# Altium project PROC154E3_SCH.PrjPcb (part 59 of 60)
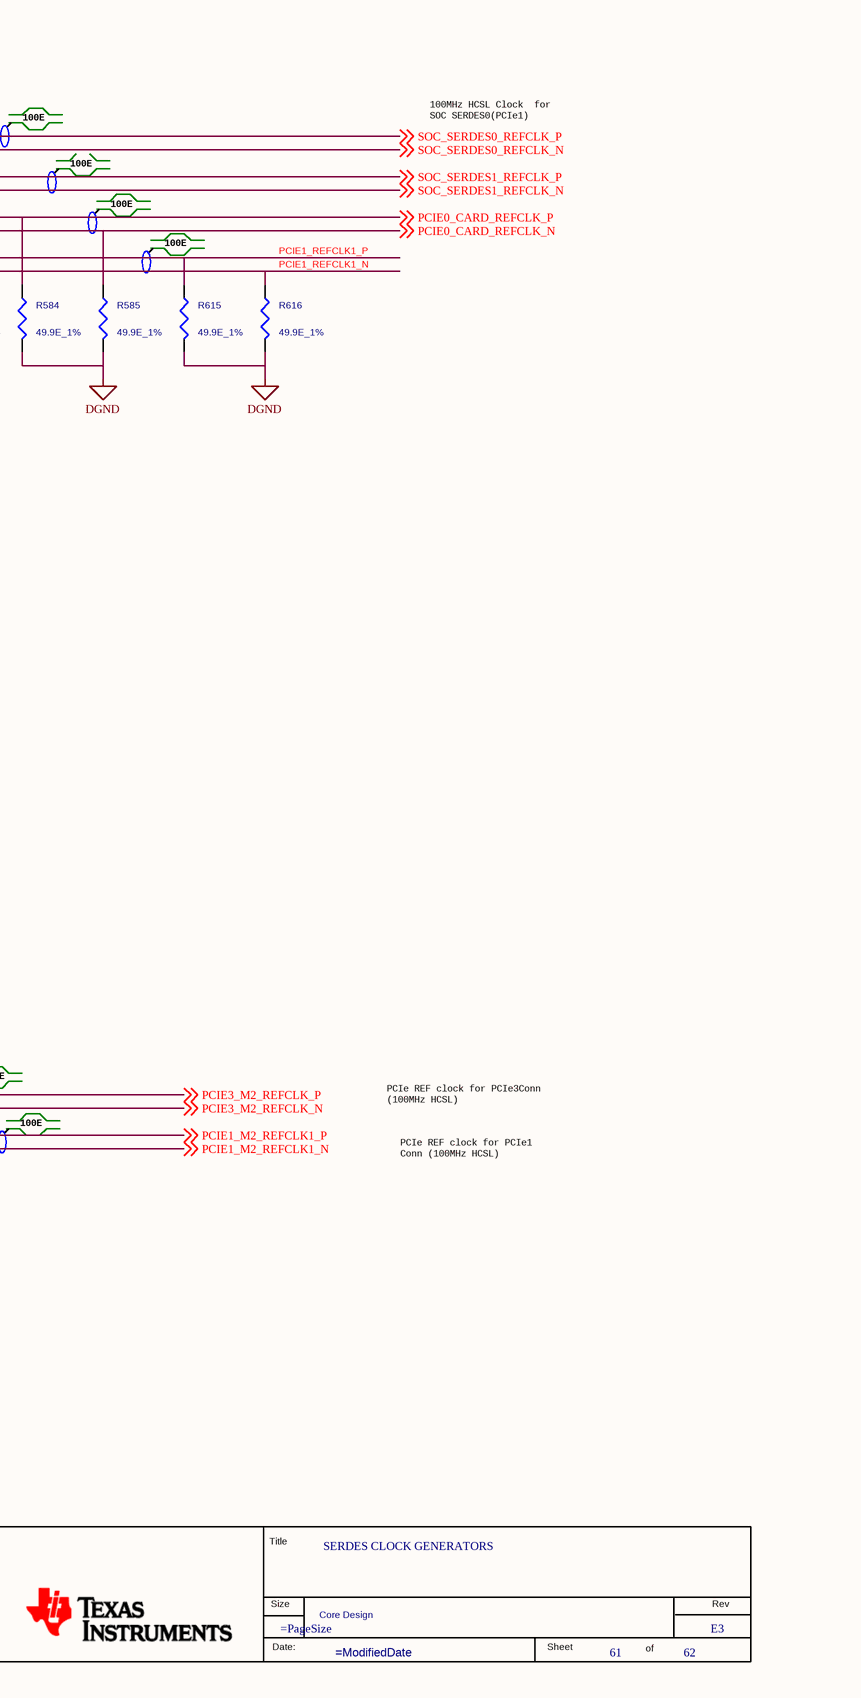
[diagram p206: 61. SERDES CLOCK GENERATORS.SchDoc, right]

## Sheet 61. SERDES CLOCK GENERATORS.SchDoc: SERDES CLOCK GENERATORS (continued)

### Library data of the parts (continued)
R608 = RESISTOR: RES 49.9E 1/10W 1% 0402; Part Reference: R608; Mistral Part No: 110009030897-R; Mfr_name: PANASONIC-ECG; Mfr_part_number: ERJ-2RKF49R9X; Part_type: RESISTORS\FIXED; Project: RED EYE; Voltage: NA; Customs_HS_Code: 85332119; Custom_Duty: 15%; Value: 49.9E_1%; PCB Footprint: RES0402_0-5; Footprint Path: Y:\MIS_DATABASE\Library\ALTIUM_TOOL\PCB_FOOTPRINTS\Altium_Footprint_Lib.PcbLib; Library Path: Y:\MIS_DATABASE\Library\ALTIUM_TOOL\SCHEMATICS_PARTS\MS_DISCRETE_Library.schlib; Tolerance: 1%; Wattage: 1/10W; Package: 0402; Distributor_name: DIGIKEY; Distributor_part_number: P49.9LCT-ND; Height: 0.40MM; Weight: 0.8mg; Temperature: -55°C+155°C; Datasheet: Y:\MIS_DATABASE\DATASHEETS\RESISTORS\PAN-ERJSER_NOV17.PDF; Crtd /date: MAZHAR/201005; Chkd/date: VASANTHA/201216; MECHANICAL 3D STEP FILE: RES0402_0-5; Library Ref: RESISTOR; Footprint Ref: RES0402_0-5; Manufacturer: PANASONIC-ECG
R613 = RESISTOR_Dup1: RES 0E 1/10W JUMPER 0402; Part Reference: R613; Manufacturer: PANASONIC-ECG; Mistral Part No: 110018030052-R; Mfr_part_number: ERJ-2GE0R00X; Part_type: RESISTORS\FIXED; IBISSP_MODLES: VALUE REPEATING 2 TIME; Project: AEGIS POM; Tolerance: NA; Customs_HS_Code: 85332119; Custom_Duty: 15%; Value: 0E; MECHANICAL 3D STEP FILE: RES0402_0-5; Mfr_name: PANASONIC-ECG; Voltage: NA; Wattage: 1/10W; Package: 0402; Distributor_name: DIGIKEY; Distributor_part_number: P0.0JCT-ND; Height: 0.40MM; Weight: 0.8mg; Temperature: -55°C+155°C; Datasheet: Y:\MIS_DATABASE\DATASHEETS\RESISTORS\PAN-ERJSER_NOV17.PDF; Crtd /date: NAVEED/201014; Chkd/date: VASANTHA/061216; Library Ref: RESISTOR; Footprint Ref: RES0402_0-5; Library Path: Y:\MIS_DATABASE\Library\ALTIUM_TOOL\SCHEMATICS_PARTS\MS_DISCRETE_Library.schlib; Footprint Path: Y:\MIS_DATABASE\Library\ALTIUM_TOOL\PCB_FOOTPRINTS\Altium_Footprint_Lib.PcbLib; PCB Footprint: RES0402_0-5
R614 = RESISTOR_Dup1: RES 0E 1/10W JUMPER 0402; Part Reference: R614; Manufacturer: PANASONIC-ECG; Mistral Part No: 110018030052-R; Mfr_part_number: ERJ-2GE0R00X; Part_type: RESISTORS\FIXED; IBISSP_MODLES: VALUE REPEATING 2 TIME; Project: AEGIS POM; Tolerance: NA; Customs_HS_Code: 85332119; Custom_Duty: 15%; Value: 0E; MECHANICAL 3D STEP FILE: RES0402_0-5; Mfr_name: PANASONIC-ECG; Voltage: NA; Wattage: 1/10W; Package: 0402; Distributor_name: DIGIKEY; Distributor_part_number: P0.0JCT-ND; Height: 0.40MM; Weight: 0.8mg; Temperature: -55°C+155°C; Datasheet: Y:\MIS_DATABASE\DATASHEETS\RESISTORS\PAN-ERJSER_NOV17.PDF; Crtd /date: NAVEED/201014; Chkd/date: VASANTHA/061216; Library Ref: RESISTOR; Footprint Ref: RES0402_0-5; Library Path: Y:\MIS_DATABASE\Library\ALTIUM_TOOL\SCHEMATICS_PARTS\MS_DISCRETE_Library.schlib; Footprint Path: Y:\MIS_DATABASE\Library\ALTIUM_TOOL\PCB_FOOTPRINTS\Altium_Footprint_Lib.PcbLib; PCB Footprint: RES0402_0-5
R615 = RESISTOR: RES 49.9E 1/10W 1% 0402; Part Reference: R615; Mistral Part No: 110009030897-R; Mfr_name: PANASONIC-ECG; Mfr_part_number: ERJ-2RKF49R9X; Part_type: RESISTORS\FIXED; Project: RED EYE; Voltage: NA; Customs_HS_Code: 85332119; Custom_Duty: 15%; Value: 49.9E_1%; PCB Footprint: RES0402_0-5; Footprint Ref: RES0402_0-5; Library Ref: RESISTOR; Footprint Path: Y:\MIS_DATABASE\Library\ALTIUM_TOOL\PCB_FOOTPRINTS\Altium_Footprint_Lib.PcbLib; Library Path: Y:\MIS_DATABASE\Library\ALTIUM_TOOL\SCHEMATICS_PARTS\MS_DISCRETE_Library.schlib; Tolerance: 1%; Wattage: 1/10W; Package: 0402; Distributor_name: DIGIKEY; Distributor_part_number: P49.9LCT-ND; Height: 0.40MM; Weight: 0.8mg; Temperature: -55°C+155°C; Datasheet: Y:\MIS_DATABASE\DATASHEETS\RESISTORS\PAN-ERJSER_NOV17.PDF; Crtd /date: MAZHAR/201005; Chkd/date: VASANTHA/201216; MECHANICAL 3D STEP FILE: RES0402_0-5; Manufacturer: PANASONIC-ECG
R616 = RESISTOR: RES 49.9E 1/10W 1% 0402; Part Reference: R616; Manufacturer: PANASONIC-ECG; Mistral Part No: 110009030897-R; Mfr_part_number: ERJ-2RKF49R9X; Part_type: RESISTORS\FIXED; Project: RED EYE; Voltage: NA; Customs_HS_Code: 85332119; Custom_Duty: 15%; Value: 49.9E_1%; PCB Footprint: RES0402_0-5; Footprint Ref: RES0402_0-5; Library Ref: RESISTOR; Mfr_name: PANASONIC-ECG; Tolerance: 1%; Wattage: 1/10W; Package: 0402; Distributor_name: DIGIKEY; Distributor_part_number: P49.9LCT-ND; Height: 0.40MM; Weight: 0.8mg; Temperature: -55°C+155°C; Datasheet: Y:\MIS_DATABASE\DATASHEETS\RESISTORS\PAN-ERJSER_NOV17.PDF; Crtd /date: MAZHAR/201005; Chkd/date: VASANTHA/201216; MECHANICAL 3D STEP FILE: RES0402_0-5; Library Path: Y:\MIS_DATABASE\Library\ALTIUM_TOOL\SCHEMATICS_PARTS\MS_DISCRETE_Library.schlib; Footprint Path: Y:\MIS_DATABASE\Library\ALTIUM_TOOL\PCB_FOOTPRINTS\Altium_Footprint_Lib.PcbLib
R617 = RESISTOR_Dup2: RES 10K 1/16W 5% 0402; Part Reference: R617; Mistral Part No: 110011060021-R; Mfr_name: YAGEO AMERICA; Mfr_part_number: RC0402JR-0710KL; Part_type: RESISTORS\FIXED; Project: HSE; Voltage: NA; Customs_HS_Code: 85332119; Custom_Duty: 15%; Value: 10K; Footprint Path: Y:\MIS_DATABASE\Library\ALTIUM_TOOL\PCB_FOOTPRINTS\Altium_Footprint_Lib.PcbLib; Library Path: Y:\MIS_DATABASE\Library\ALTIUM_TOOL\SCHEMATICS_PARTS\MS_DISCRETE_Library.schlib; Footprint Ref: RES0402_0-5; Library Ref: RESISTOR; Tolerance: 5%; Wattage: 1/16W; Package: 0402; Distributor_name: DIGIKEY; Distributor_part_number: 311-10KJRCT-ND; Height: 0.40MM; Weight: 0.65mg; Temperature: -55°C+155°C; Datasheet: Y:\MIS_DATABASE\DATASHEETS\RESISTORS\RCXXXXL-SER_MAR18.PDF; Crtd /date: MAZHAR/230805; Chkd/date: VASANTHA/061216; MECHANICAL 3D STEP FILE: RES0402_0-5; Manufacturer: YAGEO AMERICA; PCB Footprint: RES0402_0-5
R618 = RESISTOR_Dup2: RES 10K 1/16W 5% 0402; Part Reference: R618; Manufacturer: YAGEO AMERICA; Part_type: RESISTORS\FIXED; Mfr_part_number: RC0402JR-0710KL; Mistral Part No: 110011060021-R; Custom_Duty: 15%; Customs_HS_Code: 85332119; Voltage: NA; Project: HSE; Value: 10K; MECHANICAL 3D STEP FILE: RES0402_0-5; Chkd/date: VASANTHA/061216; Crtd /date: MAZHAR/230805; Datasheet: Y:\MIS_DATABASE\DATASHEETS\RESISTORS\RCXXXXL-SER_MAR18.PDF; Temperature: -55°C+155°C; Weight: 0.65mg; Height: 0.40MM; Distributor_part_number: 311-10KJRCT-ND; Distributor_name: DIGIKEY; Package: 0402; Wattage: 1/16W; Tolerance: 5%; Mfr_name: YAGEO AMERICA; Library Ref: RESISTOR; Footprint Ref: RES0402_0-5; Library Path: Y:\MIS_DATABASE\Library\ALTIUM_TOOL\SCHEMATICS_PARTS\MS_DISCRETE_Library.schlib; Footprint Path: Y:\MIS_DATABASE\Library\ALTIUM_TOOL\PCB_FOOTPRINTS\Altium_Footprint_Lib.PcbLib; PCB Footprint: RES0402_0-5
R619 = RESISTOR_Dup2: RES 10K 1/16W 5% 0402; Part Reference: R619; Manufacturer: YAGEO AMERICA; Part_type: RESISTORS\FIXED; Mfr_part_number: RC0402JR-0710KL; Mistral Part No: 110011060021-R; Custom_Duty: 15%; Customs_HS_Code: 85332119; Voltage: NA; Project: HSE; Value: 10K; MECHANICAL 3D STEP FILE: RES0402_0-5; Chkd/date: VASANTHA/061216; Crtd /date: MAZHAR/230805; Datasheet: Y:\MIS_DATABASE\DATASHEETS\RESISTORS\RCXXXXL-SER_MAR18.PDF; Temperature: -55°C+155°C; Weight: 0.65mg; Height: 0.40MM; Distributor_part_number: 311-10KJRCT-ND; Distributor_name: DIGIKEY; Package: 0402; Wattage: 1/16W; Tolerance: 5%; Mfr_name: YAGEO AMERICA; Library Ref: RESISTOR; Footprint Ref: RES0402_0-5; Library Path: Y:\MIS_DATABASE\Library\ALTIUM_TOOL\SCHEMATICS_PARTS\MS_DISCRETE_Library.schlib; Footprint Path: Y:\MIS_DATABASE\Library\ALTIUM_TOOL\PCB_FOOTPRINTS\Altium_Footprint_Lib.PcbLib; PCB Footprint: RES0402_0-5
R689 = RESISTOR: RES 33E 1/10W 1% 0402; Part Reference: R689; Manufacturer: PANASONIC-ECG; Mistral Part No: 110014110006-R; Mfr_part_number: ERJ-2RKF33R0X; Part_type: RESISTORS\FIXED; Project: ZK BIOMETRIC; Voltage: NA; Customs_HS_Code: 85332119; Custom_Duty: 15%; Value: 33E_1%; PCB Footprint: RES0402_0-5; Mfr_name: PANASONIC-ECG; Tolerance: 1%; Wattage: 1/10W; Package: 0402; Distributor_name: DIGIKEY; Distributor_part_number: P33.0LCT-ND; Height: 0.40MM; Weight: 0.8mg; Temperature: -55°C+155°C; Datasheet: Y:\MIS_DATABASE\DATASHEETS\RESISTORS\PAN-ERJSER_NOV17.PDF; Crtd /date: JEBRAN/171114; Chkd/date: VASANTHA/061216; MECHANICAL 3D STEP FILE: RES0402_0-5; Library Ref: RESISTOR; Footprint Ref: RES0402_0-5; Library Path: Y:\MIS_DATABASE\Library\ALTIUM_TOOL\SCHEMATICS_PARTS\MS_DISCRETE_Library.schlib; Footprint Path: Y:\MIS_DATABASE\Library\ALTIUM_TOOL\PCB_FOOTPRINTS\Altium_Footprint_Lib.PcbLib
R690 = RESISTOR: RES 33E 1/10W 1% 0402; Part Reference: R690; Manufacturer: PANASONIC-ECG; Part_type: RESISTORS\FIXED; Mfr_part_number: ERJ-2RKF33R0X; Mistral Part No: 110014110006-R; Custom_Duty: 15%; Customs_HS_Code: 85332119; Voltage: NA; Project: ZK BIOMETRIC; Value: 33E_1%; PCB Footprint: RES0402_0-5; MECHANICAL 3D STEP FILE: RES0402_0-5; Chkd/date: VASANTHA/061216; Crtd /date: JEBRAN/171114; Datasheet: Y:\MIS_DATABASE\DATASHEETS\RESISTORS\PAN-ERJSER_NOV17.PDF; Temperature: -55°C+155°C; Weight: 0.8mg; Height: 0.40MM; Distributor_part_number: P33.0LCT-ND; Distributor_name: DIGIKEY; Package: 0402; Wattage: 1/10W; Tolerance: 1%; Mfr_name: PANASONIC-ECG; Library Ref: RESISTOR; Footprint Ref: RES0402_0-5; Library Path: Y:\MIS_DATABASE\Library\ALTIUM_TOOL\SCHEMATICS_PARTS\MS_DISCRETE_Library.schlib; Footprint Path: Y:\MIS_DATABASE\Library\ALTIUM_TOOL\PCB_FOOTPRINTS\Altium_Footprint_Lib.PcbLib
R691 = RESISTOR: RES 33E 1/10W 1% 0402; Part Reference: R691; Mistral Part No: 110014110006-R; Mfr_name: PANASONIC-ECG; Mfr_part_number: ERJ-2RKF33R0X; Part_type: RESISTORS\FIXED; Project: ZK BIOMETRIC; Voltage: NA; Customs_HS_Code: 85332119; Custom_Duty: 15%; Value: 33E_1%; PCB Footprint: RES0402_0-5; Footprint Path: Y:\MIS_DATABASE\Library\ALTIUM_TOOL\PCB_FOOTPRINTS\Altium_Footprint_Lib.PcbLib; Library Path: Y:\MIS_DATABASE\Library\ALTIUM_TOOL\SCHEMATICS_PARTS\MS_DISCRETE_Library.schlib; Footprint Ref: RES0402_0-5; Library Ref: RESISTOR; Tolerance: 1%; Wattage: 1/10W; Package: 0402; Distributor_name: DIGIKEY; Distributor_part_number: P33.0LCT-ND; Height: 0.40MM; Weight: 0.8mg; Temperature: -55°C+155°C; Datasheet: Y:\MIS_DATABASE\DATASHEETS\RESISTORS\PAN-ERJSER_NOV17.PDF; Crtd /date: JEBRAN/171114; Chkd/date: VASANTHA/061216; MECHANICAL 3D STEP FILE: RES0402_0-5; Manufacturer: PANASONIC-ECG
R692 = RESISTOR: RES 33E 1/10W 1% 0402; Part Reference: R692; Part_type: RESISTORS\FIXED; Mfr_part_number: ERJ-2RKF33R0X; Mfr_name: PANASONIC-ECG; Mistral Part No: 110014110006-R; Custom_Duty: 15%; Customs_HS_Code: 85332119; Voltage: NA; Project: ZK BIOMETRIC; Value: 33E_1%; PCB Footprint: RES0402_0-5; Footprint Path: Y:\MIS_DATABASE\Library\ALTIUM_TOOL\PCB_FOOTPRINTS\Altium_Footprint_Lib.PcbLib; Library Path: Y:\MIS_DATABASE\Library\ALTIUM_TOOL\SCHEMATICS_PARTS\MS_DISCRETE_Library.schlib; Footprint Ref: RES0402_0-5; Library Ref: RESISTOR; MECHANICAL 3D STEP FILE: RES0402_0-5; Chkd/date: VASANTHA/061216; Crtd /date: JEBRAN/171114; Datasheet: Y:\MIS_DATABASE\DATASHEETS\RESISTORS\PAN-ERJSER_NOV17.PDF; Temperature: -55°C+155°C; Weight: 0.8mg; Height: 0.40MM; Distributor_part_number: P33.0LCT-ND; Distributor_name: DIGIKEY; Package: 0402; Wattage: 1/10W; Tolerance: 1%; Manufacturer: PANASONIC-ECG
R693 = RESISTOR: RES 33E 1/10W 1% 0402; Part Reference: R693; Manufacturer: PANASONIC-ECG; Part_type: RESISTORS\FIXED; Mfr_part_number: ERJ-2RKF33R0X; Mistral Part No: 110014110006-R; Custom_Duty: 15%; Customs_HS_Code: 85332119; Voltage: NA; Project: ZK BIOMETRIC; Value: 33E_1%; PCB Footprint: RES0402_0-5; MECHANICAL 3D STEP FILE: RES0402_0-5; Chkd/date: VASANTHA/061216; Crtd /date: JEBRAN/171114; Datasheet: Y:\MIS_DATABASE\DATASHEETS\RESISTORS\PAN-ERJSER_NOV17.PDF; Temperature: -55°C+155°C; Weight: 0.8mg; Height: 0.40MM; Distributor_part_number: P33.0LCT-ND; Distributor_name: DIGIKEY; Package: 0402; Wattage: 1/10W; Tolerance: 1%; Mfr_name: PANASONIC-ECG; Library Ref: RESISTOR; Footprint Ref: RES0402_0-5; Library Path: Y:\MIS_DATABASE\Library\ALTIUM_TOOL\SCHEMATICS_PARTS\MS_DISCRETE_Library.schlib; Footprint Path: Y:\MIS_DATABASE\Library\ALTIUM_TOOL\PCB_FOOTPRINTS\Altium_Footprint_Lib.PcbLib
R694 = RESISTOR: RES 33E 1/10W 1% 0402; Part Reference: R694; Manufacturer: PANASONIC-ECG; Mistral Part No: 110014110006-R; Mfr_part_number: ERJ-2RKF33R0X; Part_type: RESISTORS\FIXED; Project: ZK BIOMETRIC; Voltage: NA; Customs_HS_Code: 85332119; Custom_Duty: 15%; Value: 33E_1%; PCB Footprint: RES0402_0-5; Mfr_name: PANASONIC-ECG; Tolerance: 1%; Wattage: 1/10W; Package: 0402; Distributor_name: DIGIKEY; Distributor_part_number: P33.0LCT-ND; Height: 0.40MM; Weight: 0.8mg; Temperature: -55°C+155°C; Datasheet: Y:\MIS_DATABASE\DATASHEETS\RESISTORS\PAN-ERJSER_NOV17.PDF; Crtd /date: JEBRAN/171114; Chkd/date: VASANTHA/061216; MECHANICAL 3D STEP FILE: RES0402_0-5; Library Ref: RESISTOR; Footprint Ref: RES0402_0-5; Library Path: Y:\MIS_DATABASE\Library\ALTIUM_TOOL\SCHEMATICS_PARTS\MS_DISCRETE_Library.schlib; Footprint Path: Y:\MIS_DATABASE\Library\ALTIUM_TOOL\PCB_FOOTPRINTS\Altium_Footprint_Lib.PcbLib
R695 = RESISTOR: RES 4.7K 1/16W 5% 0402; Part Reference: R695; Mistral Part No: 110011060001-R; Mfr_name: YAGEO AMERICA; Mfr_part_number: RC0402JR-074K7L; Part_type: RESISTORS\FIXED; Project: TMDXCSK368; Voltage: NA; Customs_HS_Code: 85332119; Custom_Duty: 15%; Value: 4.7K; PCB Footprint: RES0402_0-5; Tolerance: 5%; Wattage: 1/16W; Package: 0402; Distributor_name: DIGIKEY; Distributor_part_number: 311-4.7KJRCT-ND; Height: 0.40MM; Weight: 0.65mg; Temperature: -55°C+155°C; Datasheet: Y:\MIS_DATABASE\DATASHEETS\RESISTORS\RCXXXXL-SER_MAR18.PDF; Crtd /date: VASANTHA/130516; Chkd/date: VASANTHA/130516; Library Ref: RESISTOR; Footprint Ref: RES0402_0-5; MECHANICAL 3D STEP FILE: RES0402_0-5; Library Path: Y:\MIS_DATABASE\Library\ALTIUM_TOOL\SCHEMATICS_PARTS\MS_DISCRETE_Library.schlib; Footprint Path: Y:\MIS_DATABASE\Library\ALTIUM_TOOL\PCB_FOOTPRINTS\Altium_Footprint_Lib.PcbLib; Manufacturer: YAGEO AMERICA
R696 = RESISTOR: RES 4.7K 1/16W 5% 0402; Part Reference: R696; Manufacturer: YAGEO AMERICA; Part_type: RESISTORS\FIXED; Mfr_part_number: RC0402JR-074K7L; Mistral Part No: 110011060001-R; Custom_Duty: 15%; Customs_HS_Code: 85332119; Voltage: NA; Project: TMDXCSK368; Value: 4.7K; Footprint Path: Y:\MIS_DATABASE\Library\ALTIUM_TOOL\PCB_FOOTPRINTS\Altium_Footprint_Lib.PcbLib; Library Path: Y:\MIS_DATABASE\Library\ALTIUM_TOOL\SCHEMATICS_PARTS\MS_DISCRETE_Library.schlib; MECHANICAL 3D STEP FILE: RES0402_0-5; Footprint Ref: RES0402_0-5; Library Ref: RESISTOR; Chkd/date: VASANTHA/130516; Crtd /date: VASANTHA/130516; Datasheet: Y:\MIS_DATABASE\DATASHEETS\RESISTORS\RCXXXXL-SER_MAR18.PDF; Temperature: -55°C+155°C; Weight: 0.65mg; Height: 0.40MM; Distributor_part_number: 311-4.7KJRCT-ND; Distributor_name: DIGIKEY; Package: 0402; Wattage: 1/16W; Tolerance: 5%; Mfr_name: YAGEO AMERICA; PCB Footprint: RES0402_0-5
TP102 = TESTPOINT_Dup1: TESTPOINT CIR 40 SMD; Part Reference: TP102; Mfr_name: LOCAL; Mistral Part No: 130009030933; MECHANICAL 3D STEP FILE: NA; Project: RAINIER-3; Value: TP40_SMD; PCB Footprint: TP40_SMD; Footprint Ref: TP40_SMD; Library Ref: TESTPOINT; Footprint Path: Y:\MIS_DATABASE\Library\ALTIUM_TOOL\PCB_FOOTPRINTS\Altium_Footprint_Lib.PcbLib; Library Path: Y:\MIS_DATABASE\Library\ALTIUM_TOOL\SCHEMATICS_PARTS\MS_DISCRETE_Library.schlib; Chkd/date: MAZHAR/190505; Crtd /date: MAZHAR/190505; Datasheet: NA; Temperature: NA; Weight: NA; Height: NA; Distributor_part_number: NA; Distributor_name: NA; Package: SMD; Wattage: NA; Voltage: NA; Tolerance: NA; Part_type: TESTPOINT; Mfr_part_number: TP40_SMD; RoHS: NA; Manufacturer: LOCAL
TP103 = TESTPOINT_Dup1: TESTPOINT CIR 40 SMD; Part Reference: TP103; Mfr_name: LOCAL; Mistral Part No: 130009030933; MECHANICAL 3D STEP FILE: NA; Project: RAINIER-3; Value: TP40_SMD; Footprint Ref: TP40_SMD; Library Ref: TESTPOINT; Footprint Path: Y:\MIS_DATABASE\Library\ALTIUM_TOOL\PCB_FOOTPRINTS\Altium_Footprint_Lib.PcbLib; Library Path: Y:\MIS_DATABASE\Library\ALTIUM_TOOL\SCHEMATICS_PARTS\MS_DISCRETE_Library.schlib; Chkd/date: MAZHAR/190505; Crtd /date: MAZHAR/190505; Datasheet: NA; Temperature: NA; Weight: NA; Height: NA; Distributor_part_number: NA; Distributor_name: NA; Package: SMD; Wattage: NA; Voltage: NA; Tolerance: NA; Part_type: TESTPOINT; Mfr_part_number: TP40_SMD; RoHS: NA; Manufacturer: LOCAL; PCB Footprint: TP40_SMD
TP112 = TESTPOINT_Dup1: TESTPOINT CIR 40 SMD; Part Reference: TP112; Mfr_name: LOCAL; Mistral Part No: 130009030933; MECHANICAL 3D STEP FILE: NA; Project: RAINIER-3; Value: TP40_SMD; PCB Footprint: TP40_SMD; Footprint Ref: TP40_SMD; Library Ref: TESTPOINT; Footprint Path: Y:\MIS_DATABASE\Library\ALTIUM_TOOL\PCB_FOOTPRINTS\Altium_Footprint_Lib.PcbLib; Library Path: Y:\MIS_DATABASE\Library\ALTIUM_TOOL\SCHEMATICS_PARTS\MS_DISCRETE_Library.schlib; Chkd/date: MAZHAR/190505; Crtd /date: MAZHAR/190505; Datasheet: NA; Temperature: NA; Weight: NA; Height: NA; Distributor_part_number: NA; Distributor_name: NA; Package: SMD; Wattage: NA; Voltage: NA; Tolerance: NA; Part_type: TESTPOINT; Mfr_part_number: TP40_SMD; RoHS: NA; Manufacturer: LOCAL
TP113 = TESTPOINT_Dup1: TESTPOINT CIR 40 SMD; Part Reference: TP113; Mfr_name: LOCAL; Mistral Part No: 130009030933; MECHANICAL 3D STEP FILE: NA; Project: RAINIER-3; Value: TP40_SMD; PCB Footprint: TP40_SMD; Footprint Ref: TP40_SMD; Library Ref: TESTPOINT; Footprint Path: Y:\MIS_DATABASE\Library\ALTIUM_TOOL\PCB_FOOTPRINTS\Altium_Footprint_Lib.PcbLib; Library Path: Y:\MIS_DATABASE\Library\ALTIUM_TOOL\SCHEMATICS_PARTS\MS_DISCRETE_Library.schlib; Chkd/date: MAZHAR/190505; Crtd /date: MAZHAR/190505; Datasheet: NA; Temperature: NA; Weight: NA; Height: NA; Distributor_part_number: NA; Distributor_name: NA; Package: SMD; Wattage: NA; Voltage: NA; Tolerance: NA; Part_type: TESTPOINT; Mfr_part_number: TP40_SMD; RoHS: NA; Manufacturer: LOCAL
U112 = CDCI6214RGET_VQFN24: IC PCIE GEN4 CLOCK GENERATOR WITH PROGRAMMABLE O/P AND EEPROM VQFN24; Part Reference: U112; Manufacturer: TEXAS INSTRUMENTS; Mistral Part No: 141017100002-R; Part_type: ICS\DIGITAL\PERIPHERAL; Project: TI_SVB_MAXWELL_DUT; Tolerance: NA; Customs_HS_Code: 85423100; Custom_Duty: 15%; Value: CDCI6214RGET; Mfr_name: TEXAS INSTRUMENTS; Mfr_part_number: CDCI6214RGET; Voltage: NA; Wattage: NA; Package: VQFN24; Distributor_name: NA; Distributor_part_number: NA; Height: 1.00MM; Weight: NA; Temperature: -40°C+85°C; Datasheet: Y:\MIS_DATABASE\DATASHEETS\ICS\DIGITAL\PERIPHERAL\CDCI6214.PDF; Crtd /date: MANIRAJA/051017; Chkd/date: MANIRAJA/051017; MECHANICAL 3D STEP FILE: QFN24_19-68_160X160_1; Library Ref: CDCI6214RGET_VQFN24; PCB Footprint: QFN24_19-68_160X160_1
U113 = CDCDB400_VQFN32: IC 4-OUTPUT CLOCK BUFFER FOR PCIE GEN 1-6 VQFN32; Part Reference: U113; Part_type: ICS\DIGITAL\PERIPHERAL; Mfr_name: TEXAS INSTRUMENTS; Mistral Part No: 141022110001-R; Custom_Duty: 0.15; Customs_HS_Code: 85423100; Wattage: NA; Project: J7AHP SK BOARDS; Value: CDCDB400RHBT; PCB Footprint: QFN32_19-68_200X200_1; Footprint Path: Y:\MIS_DATABASE\Library\ALTIUM_TOOL\PCB_FOOTPRINTS\Altium_Footprint_Lib.PcbLib; Library Path: Y:\MIS_DATABASE\Library\ALTIUM_TOOL\SCHEMATICS_PARTS\MS_COMBINATIONAL_Library.schlib; MECHANICAL 3D STEP FILE: QFN32_19-68_200X200_1; Chkd/date: PRAVEEN/021122; Crtd /date: TAMILARASU/021122; Datasheet: Y:\MIS_DATABASE\DATASHEETS\ICS\DIGITAL\PERIPHERAL\CDCDB400.PDF; Temperature: -40°C+105°C; Weight: NA; Height: 1.00MM; Library Ref: CDCDB400_VQFN32; Distributor_part_number: 296-CDCDB400RHBTCT-ND; Distributor_name: DIGIKEY; Package: VQFN32; Voltage: NA; Tolerance: NA; Mfr_part_number: CDCDB400RHBT; Footprint Ref: QFN32_19-68_200X200_1
Y7 = CRY: CRY 25.000MHz 18pF SMD; Part Reference: Y7; Mistral Part No: 130016020016-R; Mfr_name: CTS; Part_type: CRYSTAL; Project: PDI_MINIPCB; Tolerance: NA; Customs_HS_Code: 85439000; Custom_Duty: 24%; Value: 25.000MHz; PCB Footprint: XTAL_ABM3_205X130_SMD_1-4; Voltage: NA; Wattage: NA; Package: SMD; Distributor_name: DIGIKEY; Distributor_part_number: CTX1175CT-ND; Height: 1.35MM; Weight: 50mg; Temperature: -40°C+85°C; Datasheet: Y:\MIS_DATABASE\DATASHEETS\MISC\CRY_OSC\445.PDF; Crtd /date: JEBRAN/090216; Chkd/date: VASANTHA/110316; Library Ref: CRY; MECHANICAL 3D STEP FILE: XTAL_ABM3_205X130_SMD_1-4; Footprint Ref: XTAL_ABM3_205X130_SMD_1-4; Library Path: Y:\MIS_DATABASE\Library\ALTIUM_TOOL\SCHEMATICS_PARTS\MS_DISCRETE_Library.schlib; Footprint Path: Y:\MIS_DATABASE\Library\ALTIUM_TOOL\PCB_FOOTPRINTS\Altium_Footprint_Lib.PcbLib; Manufacturer: CTS

## Sheet 62. SK NOTES, HW & LABELS.SchDoc: HARDWARE SCHEMATICS
size 513 x 386 mm; Project: PROC154E2(001)_SK_AM69; Issue: 1.0; RevCode: E3; Page Create Date: March  8, 1995; Variant Name: Core Design; Schematic Page Number: 62; Page Number: 62; Page Size: C; Comment: MISTRAL_TITLEBLK_CSIZE_1; Page Count: 62; Schematic Page Count: 62; Name: PROC154E2 001 SK AM69; DsnPath: C:\Users\danie\Downloads\sprr466c\PROC154E3_RP\PROC154E3_SCH.DSN; SchematicName: SCHEMATIC1; PageName: 62. SK NOTES, HW & LABELS; PageSize: C; TopSchematic: True
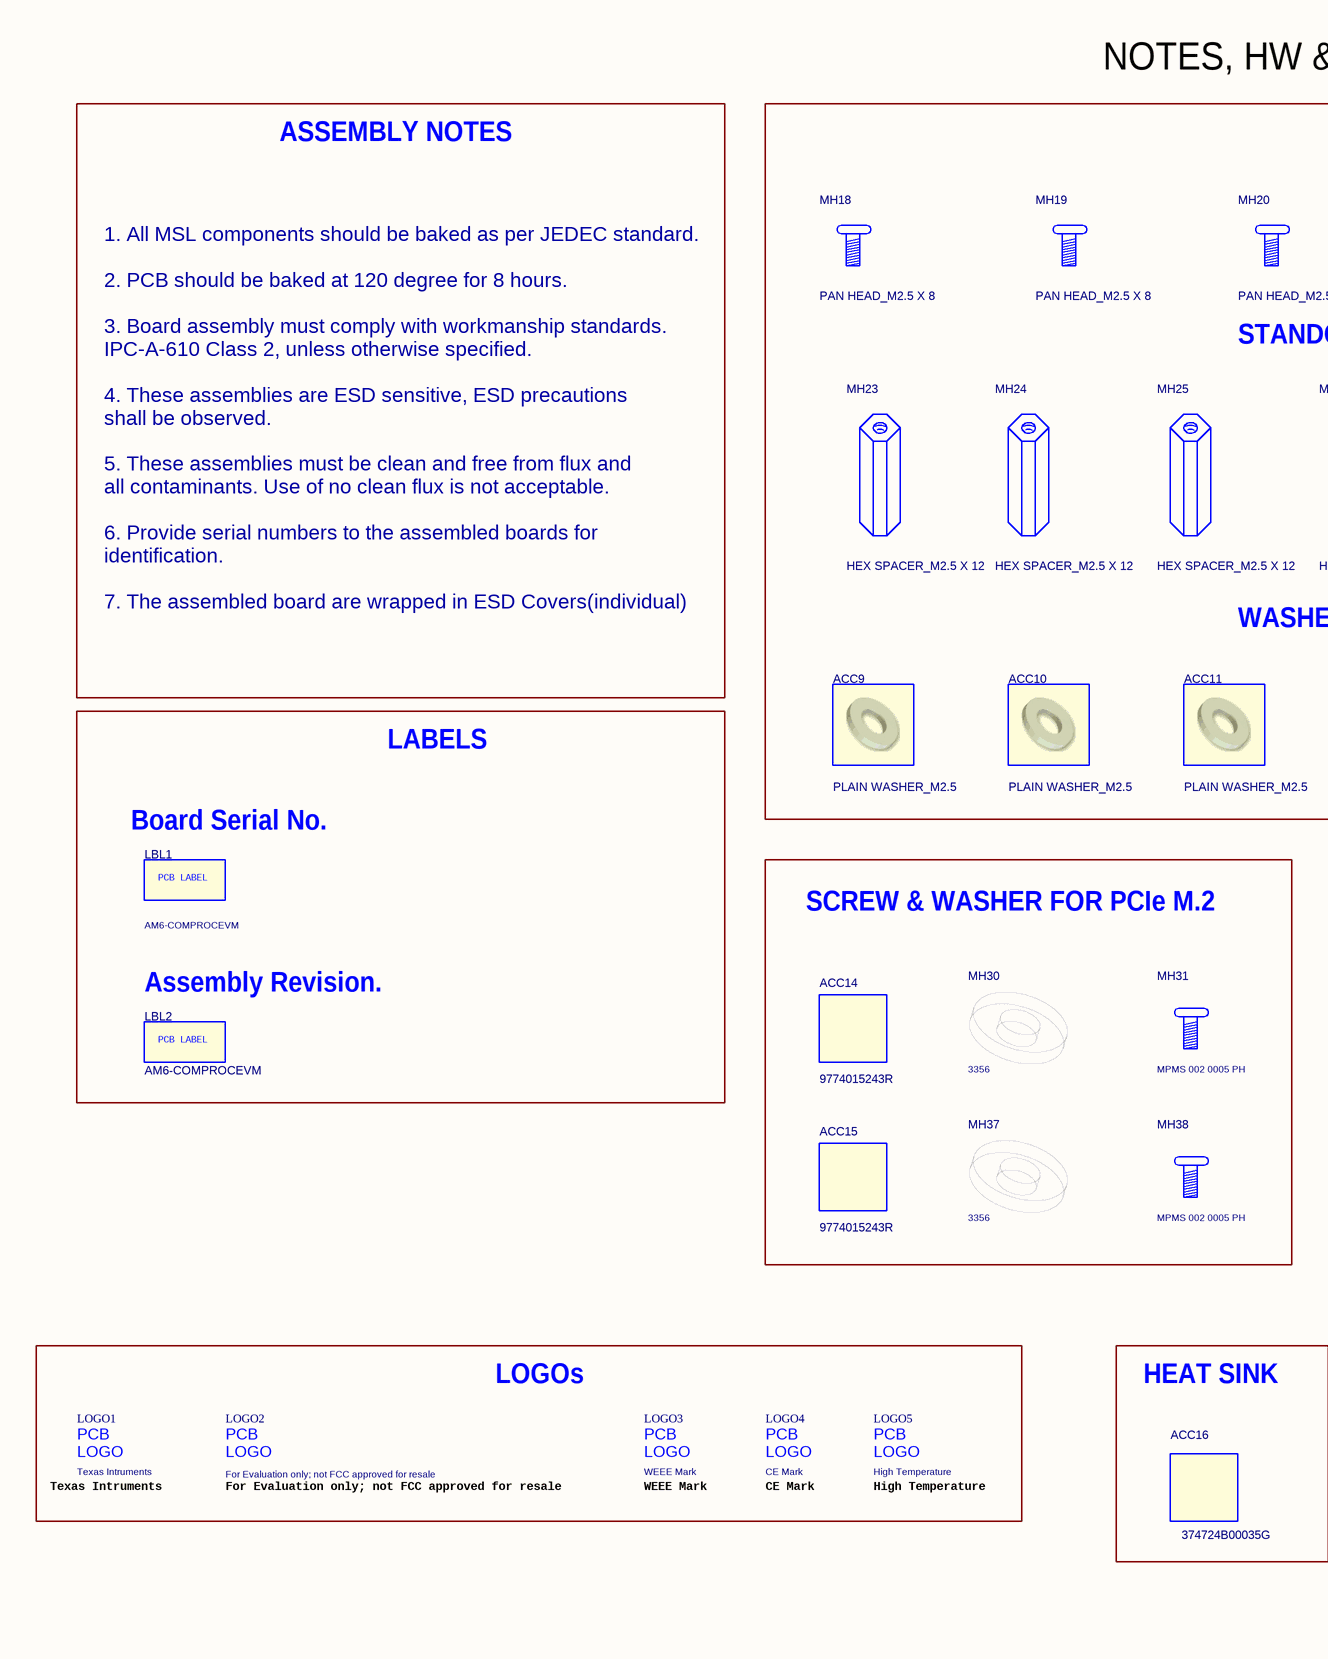
[diagram p104: 62. SK NOTES, HW & LABELS.SchDoc, left]
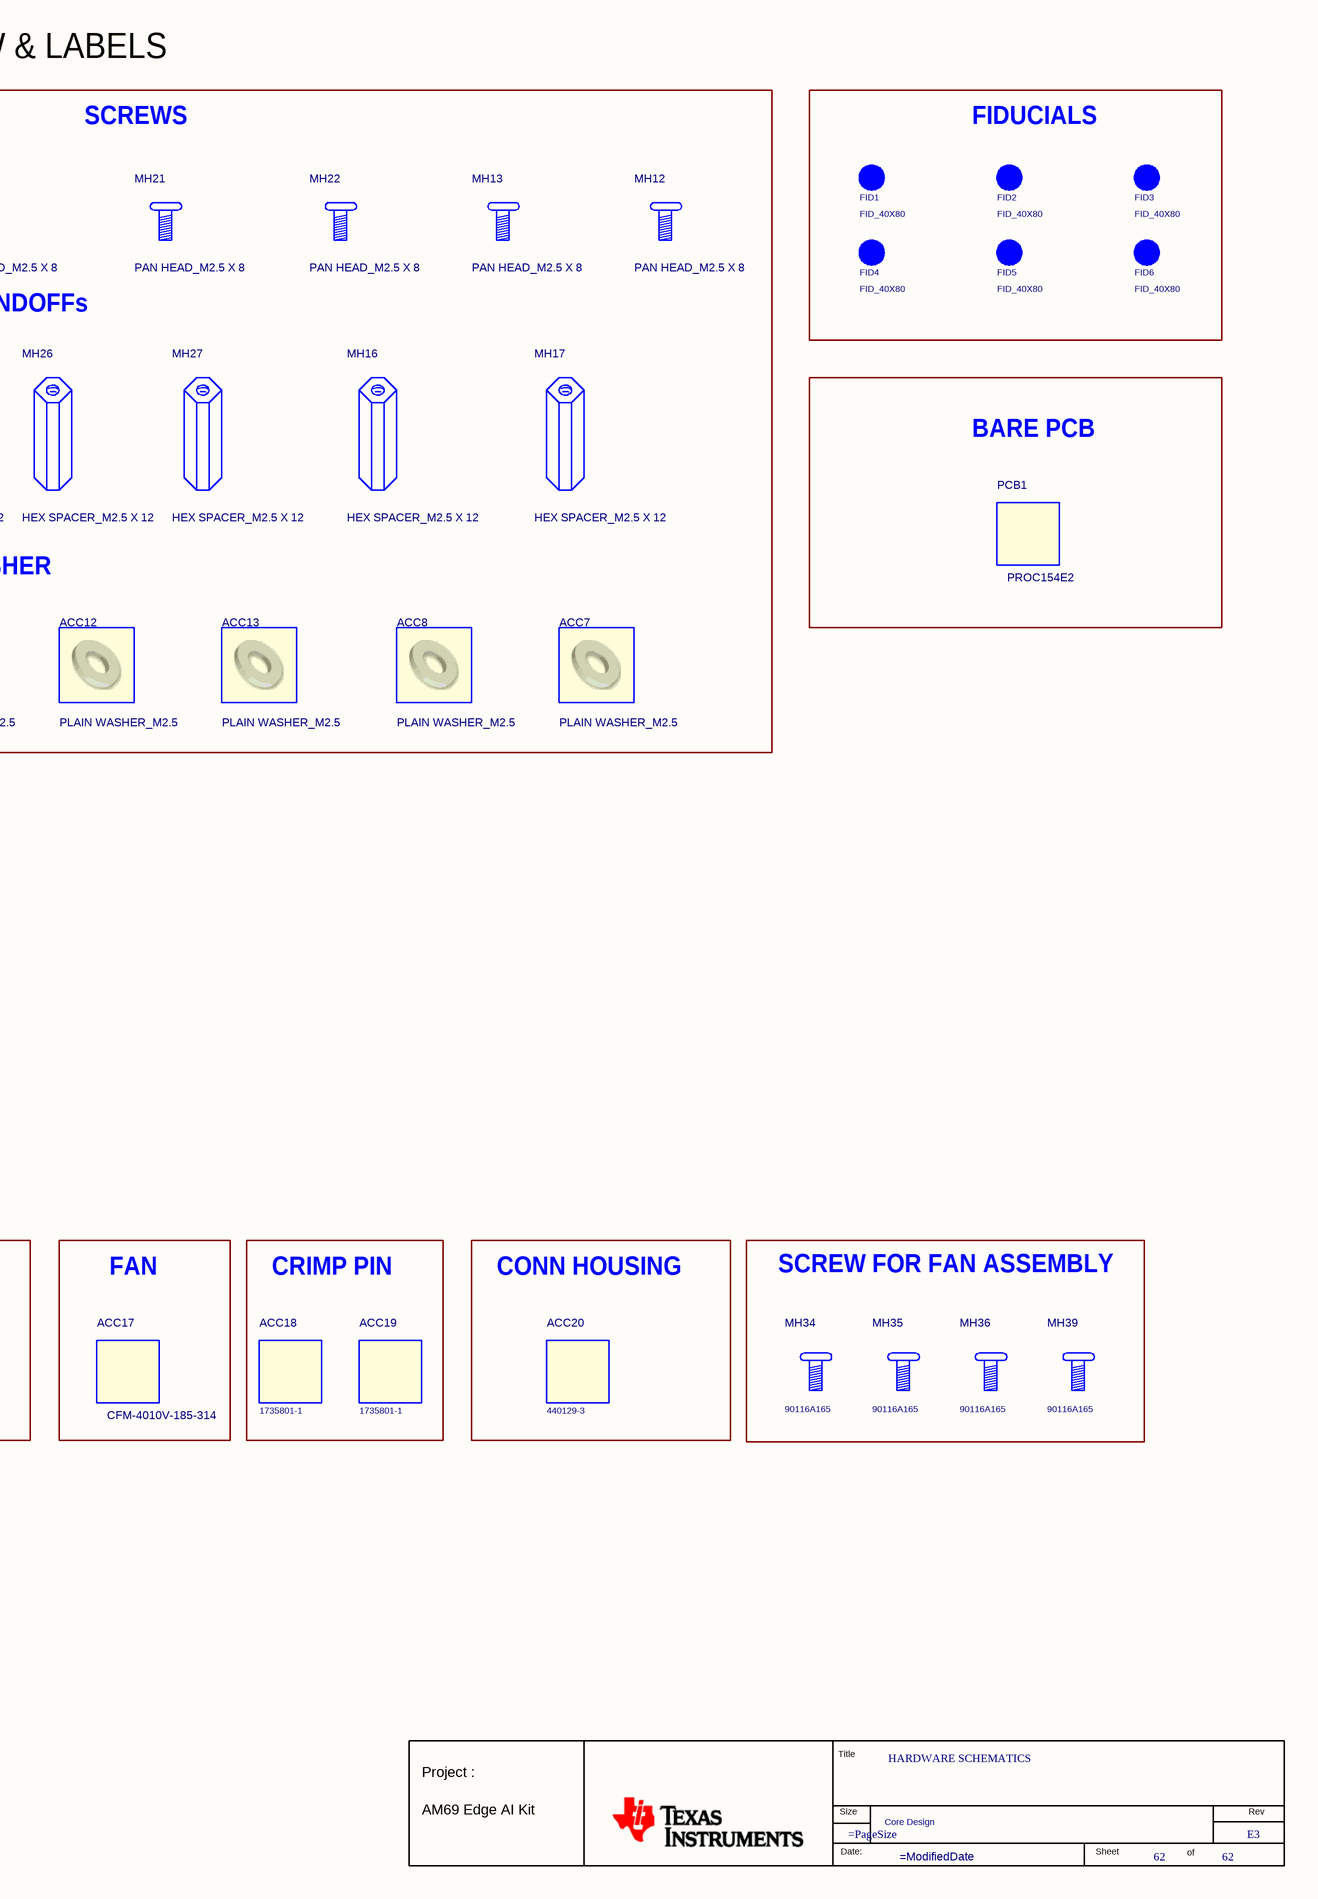
[diagram p105: 62. SK NOTES, HW & LABELS.SchDoc, right]

### Parts
(Parts that share a designator on the sheet are numbered #1, #2 ... from top to bottom, then left to right.)
*#62  RevCode: E3  Title: HARDWARE SCHEMATICS  Page Number: 62  Variant Name: Core Design  (hidden comment: MISTRAL_TITLEBLK_CSIZE_1)  (graphical)
ACC7  PLAIN WASHER_M2.5  [NA]
ACC8  PLAIN WASHER_M2.5  [NA]
ACC9  PLAIN WASHER_M2.5  [NA]
ACC10  PLAIN WASHER_M2.5  [NA]
ACC11  PLAIN WASHER_M2.5  [NA]
ACC12  PLAIN WASHER_M2.5  [NA]
ACC13  PLAIN WASHER_M2.5  [NA]
ACC14  9774015243R  [NA]
ACC15  9774015243R  [NA]
ACC16  374724B00035G  [NA]
ACC17  CFM-4010V-185-314  [NA]
ACC18  Mfr_part_number: 1735801-1  [NA]  (hidden comment: NA)
ACC19  Mfr_part_number: 1735801-1  [NA]  (hidden comment: NA)
ACC20  Mfr_part_number: 440129-3  [NA]  (hidden comment: NA)
FID1  FID_40X80  [Fiducial10-20]
FID2  FID_40X80  [Fiducial10-20]
FID3  FID_40X80  [Fiducial10-20]
FID4  FID_40X80  [Fiducial10-20]
FID5  FID_40X80  [Fiducial10-20]
FID6  FID_40X80  [Fiducial10-20]
LBL1  AM6-COMPROCEVM  [NA]
LBL2  AM6-COMPROCEVM  [NA]
LOGO1  Texas Intruments  [TI_Stacked_Overlay_Small]
LOGO2  For Evaluation only; not FCC approved for resale  [FCC_disclaimer]
LOGO3  WEEE Mark  [TI_Stacked_Overlay_Small]
LOGO4  CE Mark  [TI_Stacked_Overlay_Small]
LOGO5  High Temperature  [TI_Stacked_Overlay_Small]
MH12  PAN HEAD_M2.5 X 8  [NA]
MH13  PAN HEAD_M2.5 X 8  [NA]
MH16  HEX SPACER_M2.5 X 12  [NA]
MH17  HEX SPACER_M2.5 X 12  [NA]
MH18  PAN HEAD_M2.5 X 8  [NA]
MH19  PAN HEAD_M2.5 X 8  [NA]
MH20  PAN HEAD_M2.5 X 8  [NA]
MH21  PAN HEAD_M2.5 X 8  [NA]
MH22  PAN HEAD_M2.5 X 8  [NA]
MH23  HEX SPACER_M2.5 X 12  [NA]
MH24  HEX SPACER_M2.5 X 12  [NA]
MH25  HEX SPACER_M2.5 X 12  [NA]
MH26  HEX SPACER_M2.5 X 12  [NA]
MH27  HEX SPACER_M2.5 X 12  [NA]
MH30  Mfr_part_number: 3356  [NA]  (hidden comment: FLAT WASHER_M2)
MH31  Mfr_part_number: MPMS 002 0005 PH  [NA]  (hidden comment: PAN HEAD_M2 X 5)
MH34  Mfr_part_number: 90116A165  [NA]  (hidden comment: NA)
MH35  Mfr_part_number: 90116A165  [NA]  (hidden comment: NA)
MH36  Mfr_part_number: 90116A165  [NA]  (hidden comment: NA)
MH37  Mfr_part_number: 3356  [NA]  (hidden comment: FLAT WASHER_M2)
MH38  Mfr_part_number: MPMS 002 0005 PH  [NA]  (hidden comment: PAN HEAD_M2 X 5)
MH39  Mfr_part_number: 90116A165  [NA]  (hidden comment: NA)
PCB1  PROC154E2

### Blocks framed on the sheet
FIDUCIALS: FID1-FID6
BARE PCB: PCB1
SCREW & WASHER FOR PCIe M.2: ACC14 ACC15 MH30 MH31 MH37 MH38
LOGOs: LOGO1-LOGO5
HEAT SINK: ACC16
FAN: ACC17
CRIMP PIN: ACC18 ACC19
CONN HOUSING: ACC20
SCREW FOR FAN ASSEMBLY: MH34-MH36 MH39

### Notes on the sheet
- NOTES, HW & LABELS
- ASSEMBLY NOTES
- SCREWS
- 1. All MSL components should be baked as per JEDEC standard.
  2. PCB should be baked at 120 degree for 8 hours.
  3. Board assembly must comply with workmanship standards.
  IPC-A-610 Class 2, unless otherwise specified.
  4. These assemblies are ESD sensitive, ESD precautions
  shall be observed.
  5. These assemblies must be clean and free from flux and
  all contaminants. Use of no clean flux is not acceptable.
  6. Provide serial numbers to the assembled boards for identification.
  7. The assembled board are wrapped in ESD Covers(individual) and
  packed securely before shipment.
- (near MH26) STANDOFFs
- WASHER
- LABELS
- (near LBL1) Board Serial No.
- (near LBL2) Assembly Revision.
- Texas Intruments
- For Evaluation only; not FCC approved for resale
- WEEE Mark
- CE Mark
- High Temperature
- (in symbol ACCESSORY_THT-3-423-10) PCB LABEL
- (in symbol FCC_disclaimer) PCB; LOGO
- (in symbol MISTRAL_TITLEBLK_CSIZE_1) Title; Project :; Size; Rev; AM69 Edge AI Kit; Date:; Sheet; of
- (in symbol TI_Logo) PCB; LOGO
- (in symbol TI_Logo_Dup1) PCB; LOGO

### Library data of the parts
*#62 = MISTRAL_TITLEBLK_CSIZE_1: as *#61 on sheet 61. SERDES CLOCK GENERATORS; Page Create Date: March  8, 1995; Page Size: =PageSize; Page Count: 62; Page Modify Date: =ModifiedDate; Schematic Page Count: 62; Schematic Page Number: 62
ACC7 = WASHER_PLAIN: PLAIN WASHER FOR M2.5 NYLON; Part Reference: ACC7; Part_type: MECHANICAL\WASHERS; Mfr_part_number: MFW020A; Mfr_name: ESSENTRA; Mistral Part No: 160021030026-R; Project: J7ES_SK_BRD; Value: PLAIN WASHER_M2.5; MECHANICAL 3D STEP FILE: NA; Custom_Duty: NA; Customs_HS_Code: NA; Chkd/date: MANIRAJA/110321; Crtd /date: ALVY/110321; Datasheet: Y:\MIS_DATABASE\DATASHEETS\MISC\MECHANICAL\WASHER-MFWXXX.PDF; Temperature: NA; Weight: NA; Height: NA; Distributor_part_number: RPC1999-ND; Distributor_name: DIGIKEY; Package: NA; Wattage: NA; Voltage: NA; Tolerance: NA; PCB Footprint: NA
ACC8 = WASHER_PLAIN: PLAIN WASHER FOR M2.5 NYLON; Part Reference: ACC8; Mistral Part No: 160021030026-R; Mfr_name: ESSENTRA; Mfr_part_number: MFW020A; Part_type: MECHANICAL\WASHERS; Project: J7ES_SK_BRD; Value: PLAIN WASHER_M2.5; Tolerance: NA; Voltage: NA; Wattage: NA; Package: NA; Distributor_name: DIGIKEY; Distributor_part_number: RPC1999-ND; Height: NA; Weight: NA; Temperature: NA; Datasheet: Y:\MIS_DATABASE\DATASHEETS\MISC\MECHANICAL\WASHER-MFWXXX.PDF; Crtd /date: ALVY/110321; Chkd/date: MANIRAJA/110321; Customs_HS_Code: NA; Custom_Duty: NA; MECHANICAL 3D STEP FILE: NA; PCB Footprint: NA
ACC9 = WASHER_PLAIN: PLAIN WASHER FOR M2.5 NYLON; Part Reference: ACC9; Mistral Part No: 160021030026-R; Mfr_name: ESSENTRA; Mfr_part_number: MFW020A; Part_type: MECHANICAL\WASHERS; Project: J7ES_SK_BRD; Value: PLAIN WASHER_M2.5; Tolerance: NA; Voltage: NA; Wattage: NA; Package: NA; Distributor_name: DIGIKEY; Distributor_part_number: RPC1999-ND; Height: NA; Weight: NA; Temperature: NA; Datasheet: Y:\MIS_DATABASE\DATASHEETS\MISC\MECHANICAL\WASHER-MFWXXX.PDF; Crtd /date: ALVY/110321; Chkd/date: MANIRAJA/110321; Customs_HS_Code: NA; Custom_Duty: NA; MECHANICAL 3D STEP FILE: NA; PCB Footprint: NA
ACC10 = WASHER_PLAIN: PLAIN WASHER FOR M2.5 NYLON; Part Reference: ACC10; Part_type: MECHANICAL\WASHERS; Mfr_part_number: MFW020A; Mfr_name: ESSENTRA; Mistral Part No: 160021030026-R; Project: J7ES_SK_BRD; Value: PLAIN WASHER_M2.5; MECHANICAL 3D STEP FILE: NA; Custom_Duty: NA; Customs_HS_Code: NA; Chkd/date: MANIRAJA/110321; Crtd /date: ALVY/110321; Datasheet: Y:\MIS_DATABASE\DATASHEETS\MISC\MECHANICAL\WASHER-MFWXXX.PDF; Temperature: NA; Weight: NA; Height: NA; Distributor_part_number: RPC1999-ND; Distributor_name: DIGIKEY; Package: NA; Wattage: NA; Voltage: NA; Tolerance: NA; PCB Footprint: NA
ACC11 = WASHER_PLAIN: PLAIN WASHER FOR M2.5 NYLON; Part Reference: ACC11; Part_type: MECHANICAL\WASHERS; Mfr_part_number: MFW020A; Mfr_name: ESSENTRA; Mistral Part No: 160021030026-R; Project: J7ES_SK_BRD; Value: PLAIN WASHER_M2.5; MECHANICAL 3D STEP FILE: NA; Custom_Duty: NA; Customs_HS_Code: NA; Chkd/date: MANIRAJA/110321; Crtd /date: ALVY/110321; Datasheet: Y:\MIS_DATABASE\DATASHEETS\MISC\MECHANICAL\WASHER-MFWXXX.PDF; Temperature: NA; Weight: NA; Height: NA; Distributor_part_number: RPC1999-ND; Distributor_name: DIGIKEY; Package: NA; Wattage: NA; Voltage: NA; Tolerance: NA; PCB Footprint: NA
ACC12 = WASHER_PLAIN: PLAIN WASHER FOR M2.5 NYLON; Part Reference: ACC12; Mistral Part No: 160021030026-R; Mfr_name: ESSENTRA; Mfr_part_number: MFW020A; Part_type: MECHANICAL\WASHERS; Project: J7ES_SK_BRD; Value: PLAIN WASHER_M2.5; Tolerance: NA; Voltage: NA; Wattage: NA; Package: NA; Distributor_name: DIGIKEY; Distributor_part_number: RPC1999-ND; Height: NA; Weight: NA; Temperature: NA; Datasheet: Y:\MIS_DATABASE\DATASHEETS\MISC\MECHANICAL\WASHER-MFWXXX.PDF; Crtd /date: ALVY/110321; Chkd/date: MANIRAJA/110321; Customs_HS_Code: NA; Custom_Duty: NA; MECHANICAL 3D STEP FILE: NA; PCB Footprint: NA
ACC13 = WASHER_PLAIN: PLAIN WASHER FOR M2.5 NYLON; Part Reference: ACC13; Part_type: MECHANICAL\WASHERS; Mfr_part_number: MFW020A; Mfr_name: ESSENTRA; Mistral Part No: 160021030026-R; Project: J7ES_SK_BRD; Value: PLAIN WASHER_M2.5; MECHANICAL 3D STEP FILE: NA; Custom_Duty: NA; Customs_HS_Code: NA; Chkd/date: MANIRAJA/110321; Crtd /date: ALVY/110321; Datasheet: Y:\MIS_DATABASE\DATASHEETS\MISC\MECHANICAL\WASHER-MFWXXX.PDF; Temperature: NA; Weight: NA; Height: NA; Distributor_part_number: RPC1999-ND; Distributor_name: DIGIKEY; Package: NA; Wattage: NA; Voltage: NA; Tolerance: NA; PCB Footprint: NA
ACC14 = ACCESSORY: STANDOFF BOARD TO BOARD 1.50MM LENGTH FEMALE M2 THREADED SS; Part Reference: ACC14; Part_type: MECHANICAL\STANDOFF; Mfr_name: WURTH ELECTRONICS; Mistral Part No: 160019020049-R; Project: TI_J7ES_EVM_CP; Value: 9774015243R; MECHANICAL 3D STEP FILE: NA; Custom_Duty: NA; Customs_HS_Code: NA; Chkd/date: MANIRAJA/280219; Crtd /date: ALVY/280219; Datasheet: Y:\MIS_DATABASE\DATASHEETS\MISC\MECHANICAL\9774015243R.PDF; Temperature: NA; Weight: 178mg; Height: NA; Distributor_part_number: 732-7069-1-ND; Distributor_name: DIGIKEY; Package: SS; Wattage: NA; Voltage: NA; Tolerance: NA; Mfr_part_number: 9774015243R; PCB Footprint: NA
ACC15 = ACCESSORY: STANDOFF BOARD TO BOARD 1.50MM LENGTH FEMALE M2 THREADED SS; Part Reference: ACC15; Part_type: MECHANICAL\STANDOFF; Mfr_name: WURTH ELECTRONICS; Mistral Part No: 160019020049-R; Project: TI_J7ES_EVM_CP; Value: 9774015243R; MECHANICAL 3D STEP FILE: NA; Custom_Duty: NA; Customs_HS_Code: NA; Chkd/date: MANIRAJA/280219; Crtd /date: ALVY/280219; Datasheet: Y:\MIS_DATABASE\DATASHEETS\MISC\MECHANICAL\9774015243R.PDF; Temperature: NA; Weight: 178mg; Height: NA; Distributor_part_number: 732-7069-1-ND; Distributor_name: DIGIKEY; Package: SS; Wattage: NA; Voltage: NA; Tolerance: NA; Mfr_part_number: 9774015243R; PCB Footprint: NA
ACC16 = ACCESSORY: HEATSINK BGA 35X35X18MM W/ADH; Part Reference: ACC16; Part_type: ACCESSORIES; Mfr_name: Aavid, Thermal Division of Boyd Corporation; Project: TI_J7AHP; Value: 374724B00035G; Footprint Path: NA; Library Path: NA; MECHANICAL 3D STEP FILE: NA; Custom_Duty: NA; Customs_HS_Code: NA; Chkd/date: MANIRAJA/280920; Crtd /date: ALVY/281018; Datasheet: Y:\MIS_DATABASE\DATASHEETS\MISC\ACCESSORIES\374424BXXXXG-SER.PDF; Temperature: NA; Weight: NA; Height: NA; Library Ref: ACCESSORY; Distributor_part_number: 374724B00035G; Package: NA; Wattage: NA; Voltage: NA; Tolerance: NA; Mfr_part_number: 374724B00035G; Footprint Ref: NA; PCB Footprint: NA
ACC17 = ACCESSORY: FAN AXIAL 40X10MM 12VDC WIRE; Part Reference: ACC17; Mfr_name: CUI Devices; Part_type: ACCESSORIES; Project: TI_J7AHP; Value: CFM-4010V-185-314; Footprint Ref: NA; Mfr_part_number: CFM-4010V-185-314; Tolerance: NA; Voltage: NA; Wattage: NA; Package: NA; Distributor_part_number: CFM-4010V-185-314; Library Ref: ACCESSORY; Height: NA; Weight: NA; Temperature: NA; Datasheet: Y:\MIS_DATABASE\DATASHEETS\MISC\ACCESSORIES\374424BXXXXG-SER.PDF; Crtd /date: ALVY/281018; Chkd/date: MANIRAJA/280920; Customs_HS_Code: NA; Custom_Duty: NA; MECHANICAL 3D STEP FILE: NA; Library Path: NA; Footprint Path: NA; PCB Footprint: NA
ACC18 = ACCESSORY: CONN SOCKET 24-30AWG CRIMP TIN; Part Reference: ACC18; Mfr_name: TE Connectivity AMP Connectors; Part_type: ACCESSORIES; Project: TI_J7AHP; Value: NA; Footprint Ref: NA; Tolerance: NA; Voltage: NA; Wattage: NA; Package: NA; Distributor_part_number: 1735801-1; Library Ref: ACCESSORY; Height: NA; Weight: NA; Temperature: NA; Datasheet: Y:\MIS_DATABASE\DATASHEETS\MISC\ACCESSORIES\374424BXXXXG-SER.PDF; Crtd /date: ALVY/281018; Chkd/date: MANIRAJA/280920; Customs_HS_Code: NA; Custom_Duty: NA; MECHANICAL 3D STEP FILE: NA; Library Path: NA; Footprint Path: NA; PCB Footprint: NA
ACC19 = ACCESSORY: CONN SOCKET 24-30AWG CRIMP TIN; Part Reference: ACC19; Mfr_name: TE Connectivity AMP Connectors; Part_type: ACCESSORIES; Project: TI_J7AHP; Value: NA; Footprint Ref: NA; Tolerance: NA; Voltage: NA; Wattage: NA; Package: NA; Distributor_part_number: 1735801-1; Library Ref: ACCESSORY; Height: NA; Weight: NA; Temperature: NA; Datasheet: Y:\MIS_DATABASE\DATASHEETS\MISC\ACCESSORIES\374424BXXXXG-SER.PDF; Crtd /date: ALVY/281018; Chkd/date: MANIRAJA/280920; Customs_HS_Code: NA; Custom_Duty: NA; MECHANICAL 3D STEP FILE: NA; Library Path: NA; Footprint Path: NA; PCB Footprint: NA
ACC20 = ACCESSORY: 3 Rectangular Connectors - Housings Receptacle Natural 0.079" (2.00mm); Part Reference: ACC20; Mfr_name: TE Connectivity AMP Connectors; Part_type: ACCESSORIES; Project: TI_J7AHP; Value: NA; Footprint Ref: NA; Tolerance: NA; Voltage: NA; Wattage: NA; Package: NA; Distributor_part_number: 440129-3; Library Ref: ACCESSORY; Height: NA; Weight: NA; Temperature: NA; Datasheet: Y:\MIS_DATABASE\DATASHEETS\MISC\ACCESSORIES\374424BXXXXG-SER.PDF; Crtd /date: ALVY/281018; Chkd/date: MANIRAJA/280920; Customs_HS_Code: NA; Custom_Duty: NA; MECHANICAL 3D STEP FILE: NA; Library Path: NA; Footprint Path: NA; PCB Footprint: NA
FID1 = Fiducial: Part Reference: FID1; PCB Footprint: FID_40X80; Value: FID_40X80
FID2 = Fiducial: Part Reference: FID2; PCB Footprint: FID_40X80; Value: FID_40X80
FID3 = Fiducial: Part Reference: FID3; PCB Footprint: FID_40X80; Value: FID_40X80
FID4 = Fiducial: Part Reference: FID4; PCB Footprint: FID_40X80; Value: FID_40X80
FID5 = Fiducial: Part Reference: FID5; PCB Footprint: FID_40X80; Value: FID_40X80
FID6 = Fiducial: Part Reference: FID6; PCB Footprint: FID_40X80; Value: FID_40X80
LBL1 = ACCESSORY_THT-3-423-10: ACCESSORIE 1 WORKHORSE POLYSTER LABLE 0.25" X 1"; Part Reference: LBL1; Mistral Part No: 160018020185; Mfr_name: BRADY; Mfr_part_number: THT-103-423-10; Part_type: ACCESSORIES; Project: TI_MAXIE_CPB; Value: AM6-COMPROCEVM; Tolerance: NA; Voltage: NA; Wattage: NA; Package: NA; Distributor_name: NA; Distributor_part_number: NA; Library Ref: ACCESSORY_THT-3-423-10; Footprint Ref: NA; Height: NA; Weight: NA; Temperature: NA; Datasheet: NA; Crtd /date: ALVY/260218; Chkd/date: MANIRAJA/270218; MECHANICAL 3D STEP FILE: NA; Library Path: Y:\MIS_DATABASE\Library\ALTIUM_TOOL\SCHEMATICS_PARTS\MS_MECHANICAL_Library.schlib; Footprint Path: Y:\MIS_DATABASE\Library\ALTIUM_TOOL\PCB_FOOTPRINTS\Altium_Footprint_Lib.PcbLib; PCB Footprint: NA
LBL2 = ACCESSORY_THT-3-423-10: ACCESSORIE 1 WORKHORSE POLYSTER LABLE 0.25" X 1"; Part Reference: LBL2; Part_type: ACCESSORIES; Mfr_part_number: THT-103-423-10; Mfr_name: BRADY; Mistral Part No: 160018020185; Project: TI_MAXIE_CPB; Value: AM6-COMPROCEVM; Footprint Path: Y:\MIS_DATABASE\Library\ALTIUM_TOOL\PCB_FOOTPRINTS\Altium_Footprint_Lib.PcbLib; Library Path: Y:\MIS_DATABASE\Library\ALTIUM_TOOL\SCHEMATICS_PARTS\MS_MECHANICAL_Library.schlib; MECHANICAL 3D STEP FILE: NA; Chkd/date: MANIRAJA/270218; Crtd /date: ALVY/260218; Datasheet: NA; Temperature: NA; Weight: NA; Height: NA; Footprint Ref: NA; Library Ref: ACCESSORY_THT-3-423-10; Distributor_part_number: NA; Distributor_name: NA; Package: NA; Wattage: NA; Voltage: NA; Tolerance: NA; PCB Footprint: NA
LOGO1 LOGO3 = TI_Logo_Dup1
  LOGO1: Value: Texas Intruments
  LOGO3: Value: WEEE Mark
LOGO2 = FCC_disclaimer: PCB Footprint: FCC_disclaimer; Value: For Evaluation only; not FCC approved for resale
LOGO4 LOGO5 = TI_Logo: PCB Footprint: TI_Stacked_Overlay_Small
  LOGO4: Value: CE Mark
  LOGO5: Value: High Temperature
MH12 = SCREW_PAN: PHILLIPS PAN HEAD SCREW - M2.5 X 8 SS; Part Reference: MH12; Part_type: MECHANICAL\SCREWS; Mfr_part_number: RM2.5X8-2701; Mfr_name: APM; Mistral Part No: 160021030025-R; Project: J7ES_SK_BRD; Value: PAN HEAD_M2.5 X 8; MECHANICAL 3D STEP FILE: NA; Custom_Duty: NA; Customs_HS_Code: NA; Chkd/date: MANIRAJA/110321; Crtd /date: ALVY/110321; Datasheet: Y:\MIS_DATABASE\DATASHEETS\MISC\MECHANICAL\APM-CATALOG.PDF; Temperature: NA; Weight: NA; Height: 8.00MM; Distributor_part_number: NA; Distributor_name: NA; Package: SS; Wattage: NA; Voltage: NA; Tolerance: NA; PCB Footprint: NA
MH13 = SCREW_PAN: PHILLIPS PAN HEAD SCREW - M2.5 X 8 SS; Part Reference: MH13; Mistral Part No: 160021030025-R; Mfr_name: APM; Mfr_part_number: RM2.5X8-2701; Part_type: MECHANICAL\SCREWS; Project: J7ES_SK_BRD; Value: PAN HEAD_M2.5 X 8; Tolerance: NA; Voltage: NA; Wattage: NA; Package: SS; Distributor_name: NA; Distributor_part_number: NA; Height: 8.00MM; Weight: NA; Temperature: NA; Datasheet: Y:\MIS_DATABASE\DATASHEETS\MISC\MECHANICAL\APM-CATALOG.PDF; Crtd /date: ALVY/110321; Chkd/date: MANIRAJA/110321; Customs_HS_Code: NA; Custom_Duty: NA; MECHANICAL 3D STEP FILE: NA; PCB Footprint: NA
MH16 = HEX_SPACER_FF: HEX SPACER FEMALE TO FEMALE M2.5 X 12MM STEEL; Part Reference: MH16; Mistral Part No: 160021030024-R; Mfr_name: WURTH ELECTRONICS; Mfr_part_number: 970120151; Part_type: MECHANICAL\SPACER; Project: J7ES_SK_BRD; Value: HEX SPACER_M2.5 X 12; Tolerance: NA; Voltage: NA; Wattage: NA; Package: STEEL; Distributor_name: DIGIKEY; Distributor_part_number: 732-10552-ND; Height: 12.00MM; Weight: NA; Temperature: NA; Datasheet: Y:\MIS_DATABASE\DATASHEETS\MISC\MECHANICAL\970XXX1.PDF; Crtd /date: ALVY/110321; Chkd/date: MANIRAJA/110321; Customs_HS_Code: NA; Custom_Duty: NA; MECHANICAL 3D STEP FILE: NA; PCB Footprint: NA
MH17 = HEX_SPACER_FF: HEX SPACER FEMALE TO FEMALE M2.5 X 12MM STEEL; Part Reference: MH17; Mistral Part No: 160021030024-R; Mfr_name: WURTH ELECTRONICS; Mfr_part_number: 970120151; Part_type: MECHANICAL\SPACER; Project: J7ES_SK_BRD; Value: HEX SPACER_M2.5 X 12; Tolerance: NA; Voltage: NA; Wattage: NA; Package: STEEL; Distributor_name: DIGIKEY; Distributor_part_number: 732-10552-ND; Height: 12.00MM; Weight: NA; Temperature: NA; Datasheet: Y:\MIS_DATABASE\DATASHEETS\MISC\MECHANICAL\970XXX1.PDF; Crtd /date: ALVY/110321; Chkd/date: MANIRAJA/110321; Customs_HS_Code: NA; Custom_Duty: NA; MECHANICAL 3D STEP FILE: NA; PCB Footprint: NA
MH18 = SCREW_PAN: PHILLIPS PAN HEAD SCREW - M2.5 X 8 SS; Part Reference: MH18; Mistral Part No: 160021030025-R; Mfr_name: APM; Mfr_part_number: RM2.5X8-2701; Part_type: MECHANICAL\SCREWS; Project: J7ES_SK_BRD; Value: PAN HEAD_M2.5 X 8; Tolerance: NA; Voltage: NA; Wattage: NA; Package: SS; Distributor_name: NA; Distributor_part_number: NA; Height: 8.00MM; Weight: NA; Temperature: NA; Datasheet: Y:\MIS_DATABASE\DATASHEETS\MISC\MECHANICAL\APM-CATALOG.PDF; Crtd /date: ALVY/110321; Chkd/date: MANIRAJA/110321; Customs_HS_Code: NA; Custom_Duty: NA; MECHANICAL 3D STEP FILE: NA; PCB Footprint: NA
MH19 = SCREW_PAN: PHILLIPS PAN HEAD SCREW - M2.5 X 8 SS; Part Reference: MH19; Mistral Part No: 160021030025-R; Mfr_name: APM; Mfr_part_number: RM2.5X8-2701; Part_type: MECHANICAL\SCREWS; Project: J7ES_SK_BRD; Value: PAN HEAD_M2.5 X 8; Tolerance: NA; Voltage: NA; Wattage: NA; Package: SS; Distributor_name: NA; Distributor_part_number: NA; Height: 8.00MM; Weight: NA; Temperature: NA; Datasheet: Y:\MIS_DATABASE\DATASHEETS\MISC\MECHANICAL\APM-CATALOG.PDF; Crtd /date: ALVY/110321; Chkd/date: MANIRAJA/110321; Customs_HS_Code: NA; Custom_Duty: NA; MECHANICAL 3D STEP FILE: NA; PCB Footprint: NA
MH20 = SCREW_PAN: PHILLIPS PAN HEAD SCREW - M2.5 X 8 SS; Part Reference: MH20; Mistral Part No: 160021030025-R; Mfr_name: APM; Mfr_part_number: RM2.5X8-2701; Part_type: MECHANICAL\SCREWS; Project: J7ES_SK_BRD; Value: PAN HEAD_M2.5 X 8; Tolerance: NA; Voltage: NA; Wattage: NA; Package: SS; Distributor_name: NA; Distributor_part_number: NA; Height: 8.00MM; Weight: NA; Temperature: NA; Datasheet: Y:\MIS_DATABASE\DATASHEETS\MISC\MECHANICAL\APM-CATALOG.PDF; Crtd /date: ALVY/110321; Chkd/date: MANIRAJA/110321; Customs_HS_Code: NA; Custom_Duty: NA; MECHANICAL 3D STEP FILE: NA; PCB Footprint: NA
MH21 = SCREW_PAN: PHILLIPS PAN HEAD SCREW - M2.5 X 8 SS; Part Reference: MH21; Mistral Part No: 160021030025-R; Mfr_name: APM; Mfr_part_number: RM2.5X8-2701; Part_type: MECHANICAL\SCREWS; Project: J7ES_SK_BRD; Value: PAN HEAD_M2.5 X 8; Tolerance: NA; Voltage: NA; Wattage: NA; Package: SS; Distributor_name: NA; Distributor_part_number: NA; Height: 8.00MM; Weight: NA; Temperature: NA; Datasheet: Y:\MIS_DATABASE\DATASHEETS\MISC\MECHANICAL\APM-CATALOG.PDF; Crtd /date: ALVY/110321; Chkd/date: MANIRAJA/110321; Customs_HS_Code: NA; Custom_Duty: NA; MECHANICAL 3D STEP FILE: NA; PCB Footprint: NA
MH22 = SCREW_PAN: PHILLIPS PAN HEAD SCREW - M2.5 X 8 SS; Part Reference: MH22; Part_type: MECHANICAL\SCREWS; Mfr_part_number: RM2.5X8-2701; Mfr_name: APM; Mistral Part No: 160021030025-R; Project: J7ES_SK_BRD; Value: PAN HEAD_M2.5 X 8; MECHANICAL 3D STEP FILE: NA; Custom_Duty: NA; Customs_HS_Code: NA; Chkd/date: MANIRAJA/110321; Crtd /date: ALVY/110321; Datasheet: Y:\MIS_DATABASE\DATASHEETS\MISC\MECHANICAL\APM-CATALOG.PDF; Temperature: NA; Weight: NA; Height: 8.00MM; Distributor_part_number: NA; Distributor_name: NA; Package: SS; Wattage: NA; Voltage: NA; Tolerance: NA; PCB Footprint: NA
MH23 = HEX_SPACER_FF: HEX SPACER FEMALE TO FEMALE M2.5 X 12MM STEEL; Part Reference: MH23; Part_type: MECHANICAL\SPACER; Mfr_part_number: 970120151; Mfr_name: WURTH ELECTRONICS; Mistral Part No: 160021030024-R; Project: J7ES_SK_BRD; Value: HEX SPACER_M2.5 X 12; MECHANICAL 3D STEP FILE: NA; Custom_Duty: NA; Customs_HS_Code: NA; Chkd/date: MANIRAJA/110321; Crtd /date: ALVY/110321; Datasheet: Y:\MIS_DATABASE\DATASHEETS\MISC\MECHANICAL\970XXX1.PDF; Temperature: NA; Weight: NA; Height: 12.00MM; Distributor_part_number: 732-10552-ND; Distributor_name: DIGIKEY; Package: STEEL; Wattage: NA; Voltage: NA; Tolerance: NA; PCB Footprint: NA
MH24 = HEX_SPACER_FF: HEX SPACER FEMALE TO FEMALE M2.5 X 12MM STEEL; Part Reference: MH24; Mistral Part No: 160021030024-R; Mfr_name: WURTH ELECTRONICS; Mfr_part_number: 970120151; Part_type: MECHANICAL\SPACER; Project: J7ES_SK_BRD; Value: HEX SPACER_M2.5 X 12; Tolerance: NA; Voltage: NA; Wattage: NA; Package: STEEL; Distributor_name: DIGIKEY; Distributor_part_number: 732-10552-ND; Height: 12.00MM; Weight: NA; Temperature: NA; Datasheet: Y:\MIS_DATABASE\DATASHEETS\MISC\MECHANICAL\970XXX1.PDF; Crtd /date: ALVY/110321; Chkd/date: MANIRAJA/110321; Customs_HS_Code: NA; Custom_Duty: NA; MECHANICAL 3D STEP FILE: NA; PCB Footprint: NA
MH25 = HEX_SPACER_FF: HEX SPACER FEMALE TO FEMALE M2.5 X 12MM STEEL; Part Reference: MH25; Mistral Part No: 160021030024-R; Mfr_name: WURTH ELECTRONICS; Mfr_part_number: 970120151; Part_type: MECHANICAL\SPACER; Project: J7ES_SK_BRD; Value: HEX SPACER_M2.5 X 12; Tolerance: NA; Voltage: NA; Wattage: NA; Package: STEEL; Distributor_name: DIGIKEY; Distributor_part_number: 732-10552-ND; Height: 12.00MM; Weight: NA; Temperature: NA; Datasheet: Y:\MIS_DATABASE\DATASHEETS\MISC\MECHANICAL\970XXX1.PDF; Crtd /date: ALVY/110321; Chkd/date: MANIRAJA/110321; Customs_HS_Code: NA; Custom_Duty: NA; MECHANICAL 3D STEP FILE: NA; PCB Footprint: NA
MH26 = HEX_SPACER_FF: HEX SPACER FEMALE TO FEMALE M2.5 X 12MM STEEL; Part Reference: MH26; Mistral Part No: 160021030024-R; Mfr_name: WURTH ELECTRONICS; Mfr_part_number: 970120151; Part_type: MECHANICAL\SPACER; Project: J7ES_SK_BRD; Value: HEX SPACER_M2.5 X 12; Tolerance: NA; Voltage: NA; Wattage: NA; Package: STEEL; Distributor_name: DIGIKEY; Distributor_part_number: 732-10552-ND; Height: 12.00MM; Weight: NA; Temperature: NA; Datasheet: Y:\MIS_DATABASE\DATASHEETS\MISC\MECHANICAL\970XXX1.PDF; Crtd /date: ALVY/110321; Chkd/date: MANIRAJA/110321; Customs_HS_Code: NA; Custom_Duty: NA; MECHANICAL 3D STEP FILE: NA; PCB Footprint: NA
MH27 = HEX_SPACER_FF: HEX SPACER FEMALE TO FEMALE M2.5 X 12MM STEEL; Part Reference: MH27; Mistral Part No: 160021030024-R; Mfr_name: WURTH ELECTRONICS; Mfr_part_number: 970120151; Part_type: MECHANICAL\SPACER; Project: J7ES_SK_BRD; Value: HEX SPACER_M2.5 X 12; Tolerance: NA; Voltage: NA; Wattage: NA; Package: STEEL; Distributor_name: DIGIKEY; Distributor_part_number: 732-10552-ND; Height: 12.00MM; Weight: NA; Temperature: NA; Datasheet: Y:\MIS_DATABASE\DATASHEETS\MISC\MECHANICAL\970XXX1.PDF; Crtd /date: ALVY/110321; Chkd/date: MANIRAJA/110321; Customs_HS_Code: NA; Custom_Duty: NA; MECHANICAL 3D STEP FILE: NA; PCB Footprint: NA
MH30 = WASHER_FLAT: FLAT WASHER FOR M2 NYLON; Part Reference: MH30; Mistral Part No: 160019030017-R; Mfr_name: KEYSTONE; Part_type: MECHANICAL\WASHERS; Project: TI_J7ES_EVM_CP; Value: FLAT WASHER_M2; Footprint Ref: NA; Tolerance: NA; Voltage: NA; Wattage: NA; Package: NYLON; Distributor_name: DIGIKEY; Distributor_part_number: 36-3356-ND; Library Ref: WASHER_FLAT; Height: NA; Weight: NA; Temperature: NA; Datasheet: Y:\MIS_DATABASE\DATASHEETS\MISC\MECHANICAL\3356.PDF; Crtd /date: ALVY/110319; Chkd/date: MANIRAJA/110319; Customs_HS_Code: NA; Custom_Duty: NA; MECHANICAL 3D STEP FILE: NA; Library Path: NA; Footprint Path: NA; PCB Footprint: NA
MH31 = SCREW_PAN: PHILLIPS PAN HEAD SCREW - M2 X 5; Part Reference: MH31; Part_type: MECHANICAL\SCREWS; Mfr_name: B AND F FASTENER; Mistral Part No: 160019030026-R; Project: TI_J7ES_EVM_CP; Value: PAN HEAD_M2 X 5; Footprint Path: NA; Library Path: NA; MECHANICAL 3D STEP FILE: NA; Custom_Duty: NA; Customs_HS_Code: NA; Chkd/date: MANIRAJA/150319; Crtd /date: MANIRAJA/150319; Datasheet: Y:\MIS_DATABASE\DATASHEETS\MISC\MECHANICAL\SCREW_MPMSXXX.PDF; Temperature: NA; Weight: NA; Height: 5.00MM; Library Ref: SCREW_PAN; Distributor_part_number: H738-ND; Distributor_name: DIGIKEY; Package: NA; Wattage: NA; Voltage: NA; Tolerance: NA; Footprint Ref: NA; PCB Footprint: NA
MH34 = SCREW_PAN: 316 Stainless Steel Pan Head Phillips Screws M3 x 0.50 mm Thread, 20mm Long; Part Reference: MH34; Manufacturer: McMaster-Carr; Part_type: MECHANICAL\SCREWS; Project: TI_J7AHP; Value: NA; Footprint Path: NA; Library Path: NA; MECHANICAL 3D STEP FILE: NA; Custom_Duty: NA; Customs_HS_Code: NA; Chkd/date: MANIRAJA/110319; Crtd /date: ALVY/110319; Datasheet: Y:\MIS_DATABASE\DATASHEETS\MISC\MECHANICAL\RM3X10MM.PDF; Temperature: NA; Weight: 694.6mg; Height: 8.00MM; Library Ref: SCREW_PAN; Distributor_part_number: 90116A165; Package: SS; Wattage: NA; Voltage: NA; Tolerance: NA; Mfr_name: McMaster-Carr; Footprint Ref: NA; PCB Footprint: NA
MH35 = SCREW_PAN: 316 Stainless Steel Pan Head Phillips Screws M3 x 0.50 mm Thread, 20mm Long; Part Reference: MH35; Manufacturer: McMaster-Carr; Part_type: MECHANICAL\SCREWS; Project: TI_J7AHP; Value: NA; Footprint Path: NA; Library Path: NA; MECHANICAL 3D STEP FILE: NA; Custom_Duty: NA; Customs_HS_Code: NA; Chkd/date: MANIRAJA/110319; Crtd /date: ALVY/110319; Datasheet: Y:\MIS_DATABASE\DATASHEETS\MISC\MECHANICAL\RM3X10MM.PDF; Temperature: NA; Weight: 694.6mg; Height: 8.00MM; Library Ref: SCREW_PAN; Distributor_part_number: 90116A165; Package: SS; Wattage: NA; Voltage: NA; Tolerance: NA; Mfr_name: McMaster-Carr; Footprint Ref: NA; PCB Footprint: NA
MH36 = SCREW_PAN: 316 Stainless Steel Pan Head Phillips Screws M3 x 0.50 mm Thread, 20mm Long; Part Reference: MH36; Manufacturer: McMaster-Carr; Part_type: MECHANICAL\SCREWS; Project: TI_J7AHP; Value: NA; Footprint Path: NA; Library Path: NA; MECHANICAL 3D STEP FILE: NA; Custom_Duty: NA; Customs_HS_Code: NA; Chkd/date: MANIRAJA/110319; Crtd /date: ALVY/110319; Datasheet: Y:\MIS_DATABASE\DATASHEETS\MISC\MECHANICAL\RM3X10MM.PDF; Temperature: NA; Weight: 694.6mg; Height: 8.00MM; Library Ref: SCREW_PAN; Distributor_part_number: 90116A165; Package: SS; Wattage: NA; Voltage: NA; Tolerance: NA; Mfr_name: McMaster-Carr; Footprint Ref: NA; PCB Footprint: NA
MH37 = WASHER_FLAT: FLAT WASHER FOR M2 NYLON; Part Reference: MH37; Part_type: MECHANICAL\WASHERS; Mfr_name: KEYSTONE; Mistral Part No: 160019030017-R; Project: TI_J7ES_EVM_CP; Value: FLAT WASHER_M2; Footprint Path: NA; Library Path: NA; MECHANICAL 3D STEP FILE: NA; Custom_Duty: NA; Customs_HS_Code: NA; Chkd/date: MANIRAJA/110319; Crtd /date: ALVY/110319; Datasheet: Y:\MIS_DATABASE\DATASHEETS\MISC\MECHANICAL\3356.PDF; Temperature: NA; Weight: NA; Height: NA; Library Ref: WASHER_FLAT; Distributor_part_number: 36-3356-ND; Distributor_name: DIGIKEY; Package: NYLON; Wattage: NA; Voltage: NA; Tolerance: NA; Footprint Ref: NA; PCB Footprint: NA
MH38 = SCREW_PAN: PHILLIPS PAN HEAD SCREW - M2 X 5; Part Reference: MH38; Mistral Part No: 160019030026-R; Mfr_name: B AND F FASTENER; Part_type: MECHANICAL\SCREWS; Project: TI_J7ES_EVM_CP; Value: PAN HEAD_M2 X 5; Footprint Ref: NA; Tolerance: NA; Voltage: NA; Wattage: NA; Package: NA; Distributor_name: DIGIKEY; Distributor_part_number: H738-ND; Library Ref: SCREW_PAN; Height: 5.00MM; Weight: NA; Temperature: NA; Datasheet: Y:\MIS_DATABASE\DATASHEETS\MISC\MECHANICAL\SCREW_MPMSXXX.PDF; Crtd /date: MANIRAJA/150319; Chkd/date: MANIRAJA/150319; Customs_HS_Code: NA; Custom_Duty: NA; MECHANICAL 3D STEP FILE: NA; Library Path: NA; Footprint Path: NA; PCB Footprint: NA
MH39 = SCREW_PAN: 316 Stainless Steel Pan Head Phillips Screws M3 x 0.50 mm Thread, 20mm Long; Part Reference: MH39; Manufacturer: McMaster-Carr; Part_type: MECHANICAL\SCREWS; Project: TI_J7AHP; Value: NA; Footprint Path: NA; Library Path: NA; MECHANICAL 3D STEP FILE: NA; Custom_Duty: NA; Customs_HS_Code: NA; Chkd/date: MANIRAJA/110319; Crtd /date: ALVY/110319; Datasheet: Y:\MIS_DATABASE\DATASHEETS\MISC\MECHANICAL\RM3X10MM.PDF; Temperature: NA; Weight: 694.6mg; Height: 8.00MM; Library Ref: SCREW_PAN; Distributor_part_number: 90116A165; Package: SS; Wattage: NA; Voltage: NA; Tolerance: NA; Mfr_name: McMaster-Carr; Footprint Ref: NA; PCB Footprint: NA
PCB1 = ACCESSORY_PROC078: J7AHP SK BOARD BARE PCB REV E2; Part Reference: PCB1; Mfr_name: ANY; Value: PROC154E2; Mfr_part_number: PROC154E2